# EasyEDA Pro project CH32V003F4U6_I2C_PrototypeBoard.eprj

# Schematic Schematic1
Board Name: Board1; Create Date: 2025-08-09; Page Name: P1; Project Name: CH32V003F4U6_I2C_PrototypeBoard; Schematic Name: Schematic1; Update Date: 2025-08-13; Company: m039; Drawn: Dmitry Mozgin; Page Size: A4; Version: V1.0
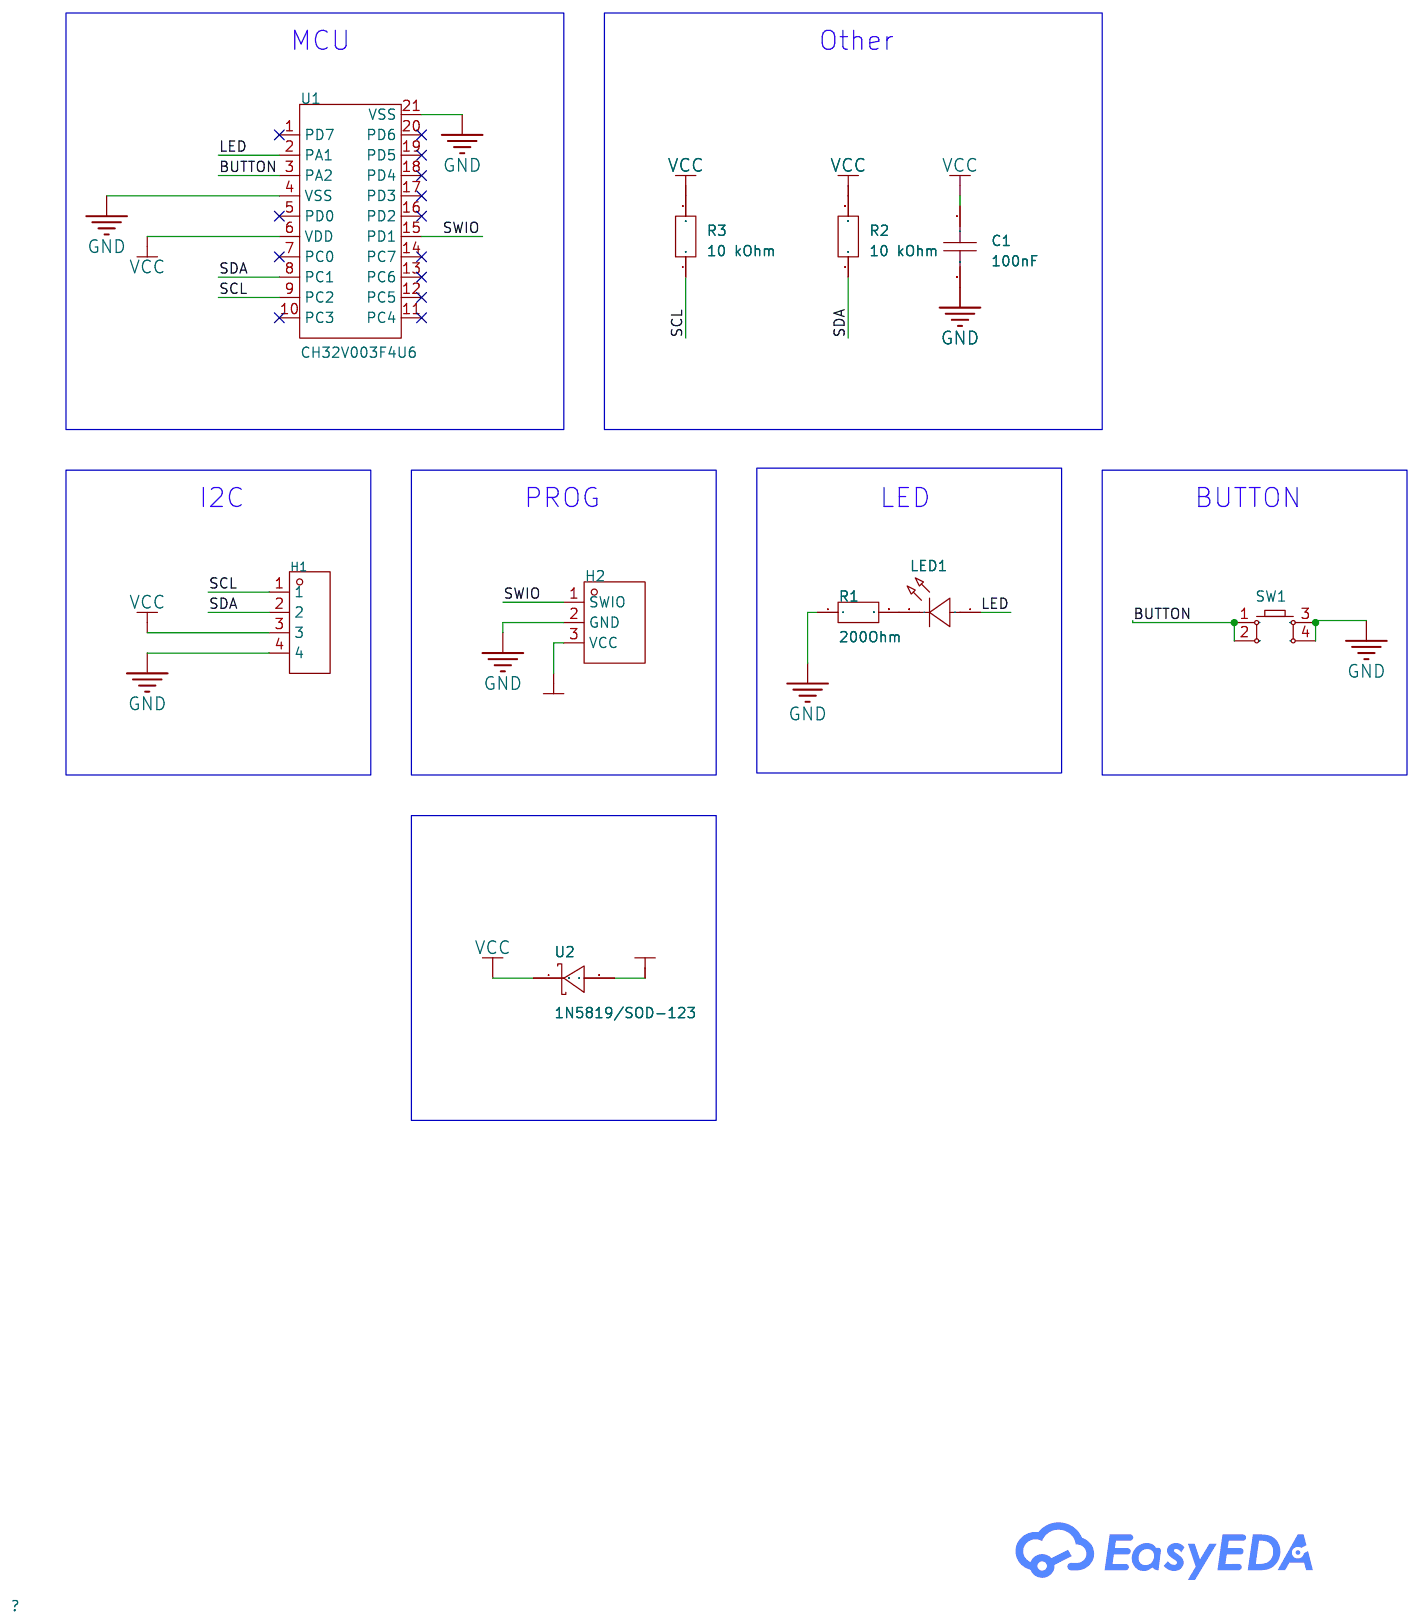
[diagram p0: schematic sheet]

## Parts
C1  100nF  [C0805]
H1  -  [HDR-TH_4P-P2.54-V-F]
H2  -  [HDR-TH_3P-P2.54-V-M]
LED1  4dcf0610a8494475a8d28c2e9e951178  [LED-SMD_L3.2-W2.4-R-RD]
R1  200Ohm  [R0805]
R2  10 kOhm  [R0805]
R3  10 kOhm  [R0805]
SW1  -  [SWITCH TACTILE NANO 3X3X2 SMD]
U1  CH32V003F4U6  [QFN-20_L3.0-W3.0-P0.40-TL-EP1.7]
U2  1N5819/SOD-123  [SOD-123_L2.7-W1.7-LS3.8-RD]

## Library data of the parts
C1 = CAP_0805: Supplier Footprint: 0805
H1 = HDR-F_2.54_1x4P: Supplier Footprint: Through
H2 = CH32V003 SWIO Header: Supplier Footprint: Through
LED1 = LED 3528 1210: LCSC Part Name: 42-21SYGC/S530-E2/TR8(GH); Supplier Part: C6705065; Manufacturer: EVERLIGHT(亿光); Manufacturer Part: 42-21SYGC/S530-E2/TR8(GH); Supplier Footprint: 1210; JLCPCB Part Class: Extended Part; Supplier: LCSC
R1-R3 = Resistor 0805
SW1 = Key_SMD_6x6x6.5: Supplier Footprint: SMD
U1 = CH32V003F4U6: Supplier Part: C5299908; Manufacturer: WCH(南京沁恒); Supplier Footprint: QFN-20(3X3); JLCPCB Part Class: Extended Part; Datasheet: https://atta.szlcsc.com/upload/public/pdf/source/20250604/86DFE64B14CD7099775DB96D45CE90A6.pdf; Supplier: LCSC; CPU Core: RISC-V; CPU Maximum Speed: 48MHz; Program Storage Size: 16KB; Number of I/O: 18
U2 = 1N5819/SOD-123: Supplier: LCSC; Supplier Part: C9900010912; Manufacturer: null; JLCPCB Part Class: Extended Part

## Nets
GND: C1.2 H1.4 H2.2(GND) R1.1 SW1.3 SW1.4 U1.4(VSS) U1.21(VSS)
VCC: C1.1 H1.3 R2.2 R3.2 U1.6(VDD) U2.1(C)
VIN: H2.3(VCC) U2.2(A)
BUTTON: SW1.1 SW1.2 U1.3(PA2)
LED: LED1.1(+) U1.2(PA1)
SCL: H1.1 R3.1 U1.9(PC2)
SDA: H1.2 R2.1 U1.8(PC1)
SWIO: H2.1(SWIO) U1.15(PD1)
$1N1829: LED1.2(-) R1.2

Not connected (* = marked no-connect by the designer): U1 1(PD7)* 5(PD0)* 7(PC0)* 10(PC3)* 11(PC4)* 12(PC5)* 13(PC6)* 14(PC7)* 16(PD2)* 17(PD3)* 18(PD4)* 19(PD5)* 20(PD6)*

## Notes on the sheet
- MCU
- Other
- I2C
- PROG
- LED
- BUTTON

# Board PCB1
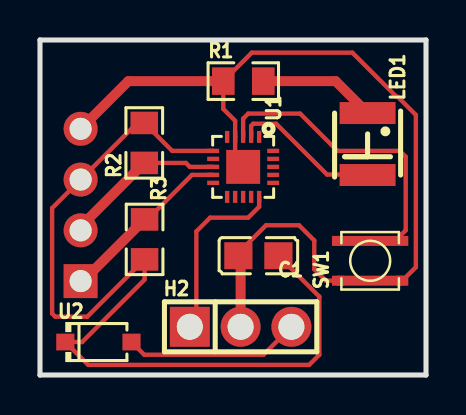
[diagram p1: board, top side]
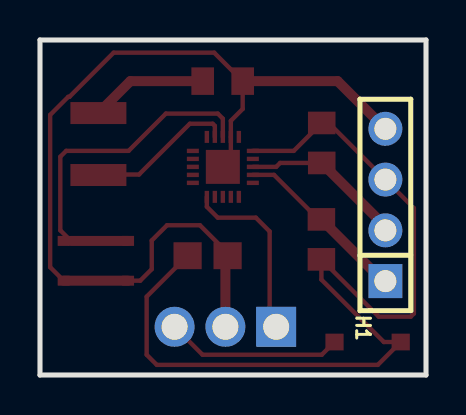
[diagram p2: board, bottom side, seen from below]

Outline 19.3 x 16.76 mm; copper layers: Top Layer, Bottom Layer. Coordinates in mm from the lower left corner of the outline.
Outline path: 0,16.76 0,0 19.3,0 19.3,16.76 0,16.76
Stack: Top Layer 0.035mm / Dielectric1 1.51mm FR4 er 4.5 / Bottom Layer 0.035mm

## Design rules (mm)
template: Custom Config
spacing copperThickness1oz (default): track to track 0.102, other pairs 0.152 to 0.3
spacing copperThickness2oz: track to track 0.203, other pairs 0.152 to 0.3
track width copperThickness1oz (default): min 0.127, default 0.22, max 2.54
track width copperThickness2oz: min 0.203, default 0.254, max 2.54
differential pair differentialPair (default): width min 0.127, default 0.254, max 2.54; gap min 0.152, default 0.152
via viaSize (default): diameter min 0.5, default 0.61, max 10; hole min 0.3, default 0.305, max 6.3

## Placement (name value [footprint] x y rotation side)
C1  100nF  [C0805]  10.92 5.97 180 top
H1  -  [HDR-TH_4P-P2.54-V-F]  2.03 8.51 90 bottom
H2  -  [HDR-TH_3P-P2.54-V-M]  10.03 2.41 0 top
LED1  4dcf0610a8494475a8d28c2e9e951178  [LED-SMD_L3.2-W2.4-R-RD]  16.38 11.56 270 top
R1  200Ohm  [R0805]  10.17 14.7 0 top
R2  10 kOhm  [R0805]  5.21 11.61 90 top
R3  10 kOhm  [R0805]  5.23 6.79 270 top
SW1  -  [SWITCH TACTILE NANO 3X3X2 SMD]  16.51 5.71 90 top
U1  CH32V003F4U6  [QFN-20_L3.0-W3.0-P0.40-TL-EP1.7]  10.16 10.41 270 top
U2  1N5819/SOD-123  [SOD-123_L2.7-W1.7-LS3.8-RD]  2.92 1.65 0 top

## Footprints (pads in the part's own frame, mm; a bottom-side part is the same pattern mirrored in y, then rotated)
C0805
  rect 1.41x1.35 smd: 1(-1,0) 2(1,0)
HDR-TH_3P-P2.54-V-M
  rect 2x2 hole 1.3: 1(-2.54,0)
  round 2 hole 1.3: 2(0,0) 3(2.54,0)
HDR-TH_4P-P2.54-V-F
  rect 1.7x1.7 hole 1.1: 1(-3.81,0)
  round 1.7 hole 1.1: 2(-1.27,0) 3(1.27,0) 4(3.81,0)
LED-SMD_L3.2-W2.4-R-RD
  rect 1.1x2.8 smd: 1(1.55,0) 2(-1.55,0)
QFN-20_L3.0-W3.0-P0.40-TL-EP1.7
  rect 0.6x0.22 smd: 1(-1.5,0.8) 2(-1.5,0.401) 3(-1.5,0) 4(-1.5,-0.4) 5(-1.5,-0.8) 11(1.5,-0.8) 12(1.5,-0.4) 13(1.5,0) 14(1.5,0.401) 15(1.5,0.8)
  rect 0.22x0.6 smd: 6(-0.8,-1.5) 7(-0.4,-1.5) 8(0,-1.5) 9(0.4,-1.5) 10(0.799,-1.5) 16(0.8,1.5) 17(0.4,1.5) 18(0,1.5) 19(-0.4,1.5) 20(-0.8,1.5)
  rect 1.7x1.7 smd: 21(0,0)
R0805
  rect 1.133x1.377 smd: 1(-1,0) 2(1,0)
SOD-123_L2.7-W1.7-LS3.8-RD
  rect 0.91x0.84 smd: 1(-1.655,0) 2(1.655,0)
SWITCH TACTILE NANO 3X3X2 SMD
  rect 0.5x0.6 smd: 1(0.995,1.609) 2(0.995,-1.61) 3(-0.995,1.61) 4(-0.995,-1.61)

## Nets
As in the schematic.

Pads without a net: U1 1 5 7 10 11 12 13 14 16 17 18 19 20

## Routing (per net, layer and track width the routed paths; a pad name or vN(x,y) marks a point on that pad's centre or on a via; arc(x,y) is an arc through that point)
GND: length 47.4
  Top Layer w0.22: SW1.4 18.8,5.4 18.8,13.01 17.89,13.92 17.83,13.92 15.62,16.13 10.59,16.13 R1.1 9.17,13.31 9.76,12.72 U1.4 9.76,10.81 U1.21 ; C1.2 9.92,6.11 11.3,7.49 12.95,7.49 13.72,6.73 13.72,5.3 14.29,4.72 SW1.3
  Top Layer w0.5: C1.2 10.03,5.86 H2.2 ; R1.1 4.42,14.7 2.03,12.32 ; SW1.4 SW1.3
VCC: length 47
  Top Layer w0.22: C1.1 13.97,3.92 13.97,1.02 13.46,0.51 2.41,0.51 U2.1 2.11,1.65 5.23,4.78 R3.2 2.37,2.92 0.76,2.92 0.61,3.08 0.61,8.35 H1.3 4.87,12.61 R2.2 6.61,11.21 U1.6
VIN: length 8.8
  Top Layer w0.22: U2.2 5.21,1.02 11.18,1.02 H2.3
BUTTON: length 17.3
  Top Layer w0.22: U1.3 10.16,12.83 10.41,13.08 13.01,13.08 14.87,11.22 17.99,11.22 18.29,10.92 18.29,7.24 17.76,6.71
  Top Layer w0.5: 17.76,6.71 SW1.1
LED: length 7.5
  Top Layer w0.22: U1.2 10.56,12.47 10.67,12.57 11.81,12.57 14.35,10.03 16.36,10.03 16.38,10.01
SCL: length 8.8
  Top Layer w0.22: R3.1 5.37,7.79 7.6,10.01 U1.9
  Top Layer w0.5: R3.1 2.14,4.7 H1.1
SDA: length 8.2
  Top Layer w0.22: R2.1 7.29,10.61 7.49,10.41 U1.8
  Top Layer w0.5: R2.1 2.03,7.43 2.03,7.24
SWIO: length 9.4
  Top Layer w0.22: H2.1 7.82,2.74 7.82,7.18 8.51,7.87 10.41,7.87 10.96,8.42 U1.15 ; 6.99,2.41 7.24,2.67
$1N1829: length 5.9
  Top Layer w0.5: LED1.2 14.79,14.7 R1.2
